# Altium schematic sheet USB Hub.SchDoc
size A4
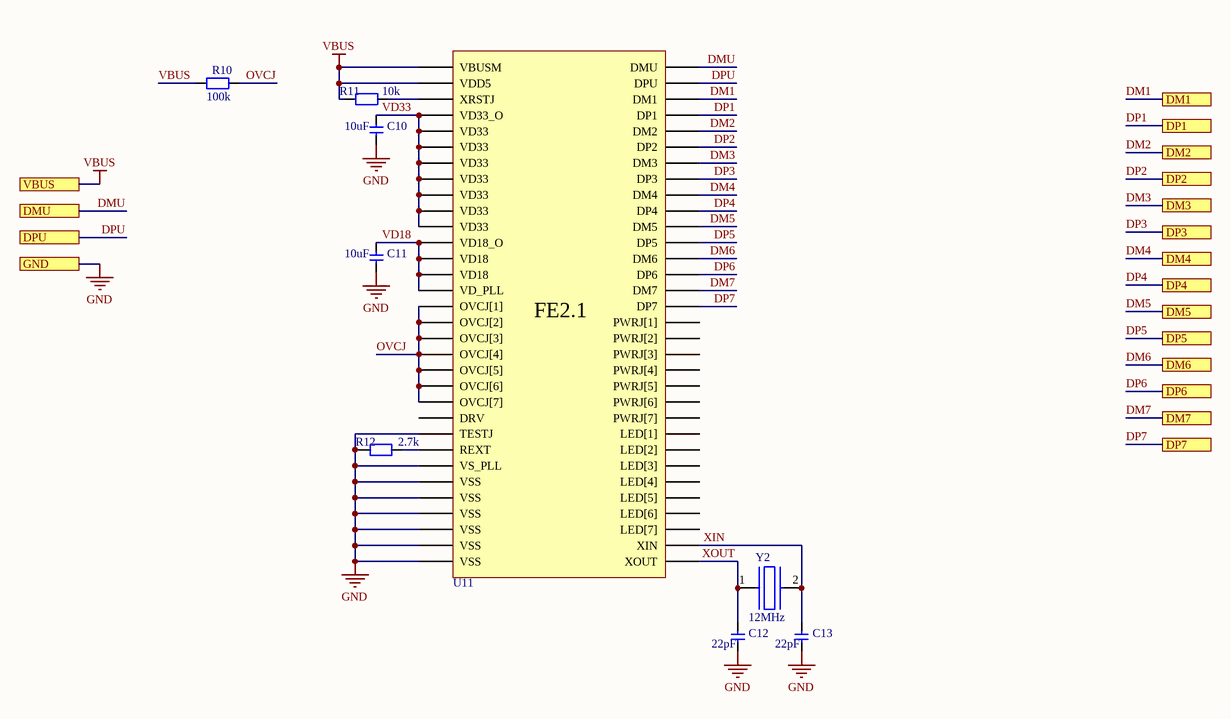
[diagram p0: USB Hub.SchDoc]

## Parts
C10  10uF  [cap0603]
C11  10uF  [cap0603]
C12  22pF  [cap0603]
C13  22pF  [cap0603]
R10  100k  [res0603]
R11  10k  [res0603]
R12  2.7k  [res0603]
U11  FE2.1  [LQFP64_N_1]  (value not drawn)
Y2  12MHz  [QSMD5.0x3.2x1.0]

## Ports
DM1, DM2, DM3, DM4, DM5, DM6, DM7, DMU, DP1, DP2, DP3, DP4, DP5, DP6, DP7, DPU, GND, VBUS

## Nets
GND: C10.1 C11.1 C12.1 C13.1 R12.1 U11.3(TESTJ) U11.11(VSS) U11.19(VSS) U11.25(VSS) U11.32(VS_PLL) U11.37(VSS) U11.43(VSS) U11.49(VSS) ; port GND
VBUS: R10.1 R11.1 U11.9(VDD5) U11.51(VBUSM) ; port VBUS
DM1: U11.26(DM1) ; port DM1
DM2: U11.23(DM2) ; port DM2
DM3: U11.20(DM3) ; port DM3
DM4: U11.17(DM4) ; port DM4
DM5: U11.41(DM5) ; port DM5
DM6: U11.44(DM6) ; port DM6
DM7: U11.47(DM7) ; port DM7
DMU: U11.38(DMU) ; port DMU
DP1: U11.27(DP1) ; port DP1
DP2: U11.24(DP2) ; port DP2
DP3: U11.21(DP3) ; port DP3
DP4: U11.18(DP4) ; port DP4
DP5: U11.42(DP5) ; port DP5
DP6: U11.45(DP6) ; port DP6
DP7: U11.48(DP7) ; port DP7
DPU: U11.39(DPU) ; port DPU
OVCJ: R10.2 U11.14(PWRJ[4]) U11.15(OVCJ[2]) U11.16(OVCJ[3]) U11.17(OVCJ[4]) U11.18(OVCJ[5]) U11.19(OVCJ[6]) U11.20(OVCJ[7])
VD18: C11.2 U11.7(VD18) U11.29(VD_PLL) U11.33(VD18_O) U11.36(VD18)
VD33: C10.2 U11.10(VD33_O) U11.16(VD33) U11.22(VD33) U11.28(VD33) U11.34(VD33) U11.40(VD33) U11.46(VD33) U11.56(VD33)
XIN: C13.2 U11.30(XIN) Y2.2
XOUT: C12.2 U11.31(XOUT) Y2.1
NetR11_2: R11.2 U11.50(XRSTJ)
NetR12_2: R12.2 U11.35(REXT)

Not connected (* = marked no-connect by the designer): U11 1(LED[5]) 2(DRV) 4(LED[1]) 5(LED[2]) 6(LED[3]) 8(LED[4]) 12(PWRJ[3]) 52(PWRJ[7]) 54(PWRJ[6]) 57(PWRJ[5]) 59(PWRJ[1]) 61(PWRJ[2]) 63(LED[7]) 64(LED[6])

## Library data of the parts
C10-C13 = Cap SMD
R10-R12 = Resistor SMD
Y2 = Quartz